# Altium schematic sheet 555 timer schematic.SchDoc
size A4; SheetNumber: 1; SheetTotal: 1
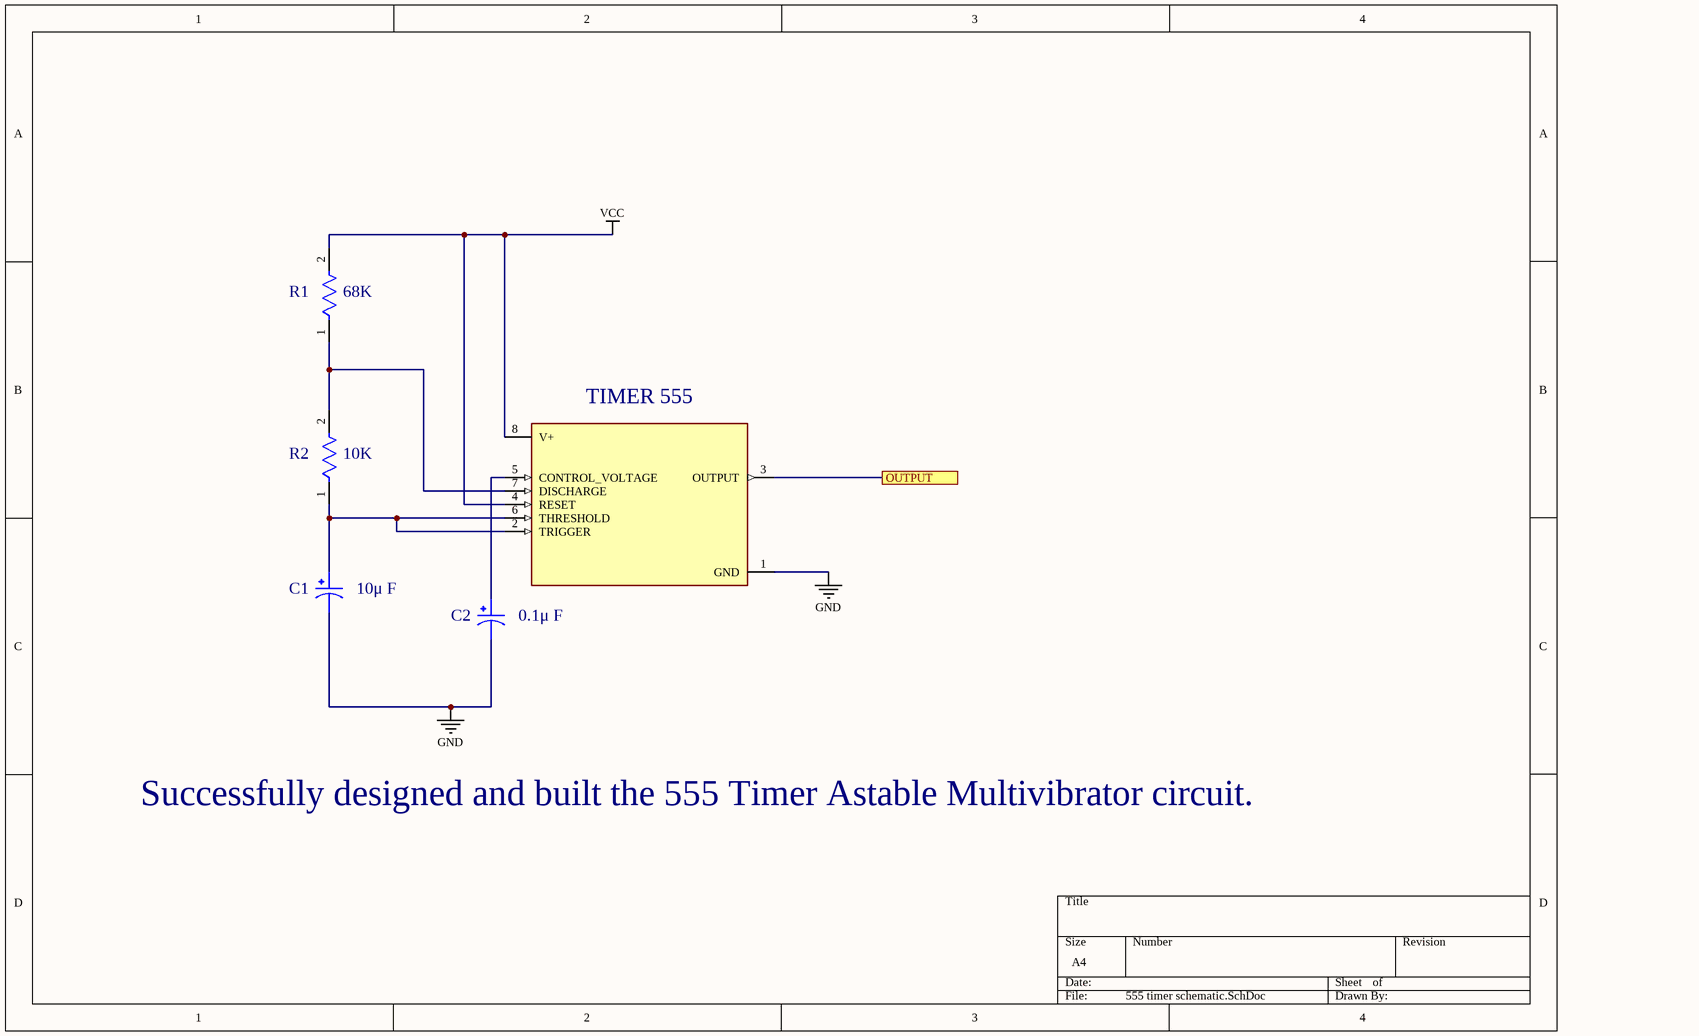
[diagram p0: 555 timer schematic.SchDoc]

## Parts
C1  10μ F  [CAPPRD500W60D1330H2700]
C2  0.1μ F  [CAPPRD500W60D1330H2700]
R1  68K  [FP-MFR-25-MFG]
R2  10K  [FP-MFR-25-MFG]
TIMER_555  LM555CN/NOPB  [DIP794W45P254L959H508Q8]  (value not drawn)

## Ports
OUTPUT 

## Nets
GND: C1.2 C2.2 TIMER_555.1(GND)
VCC: R1.2 TIMER_555.4(RESET) TIMER_555.8(V+)
OUTPUT : TIMER_555.3(OUTPUT) ; port OUTPUT 
NetC1_1: C1.1 R2.1 TIMER_555.2(TRIGGER) TIMER_555.6(THRESHOLD)
NetC2_1: C2.1 TIMER_555.5(CONTROL_VOLTAGE)
NetR1_1: R1.1 R2.2 TIMER_555.7(DISCHARGE)

## Notes on the sheet
- Successfully designed and built the 555 Timer Astable Multivibrator circuit.

## Library data of the parts
C1 C2 = 478CKS010M: 4700 ÂµF 10 V Aluminum Electrolytic Capacitors Radial, Can 98.8mOhm @ 120Hz 2000 Hrs @ 85Â°C; MF: Illinois Capacitor; SnapEDA_Link: https://www.snapeda.com/parts/478CKS010M/Illinois+Capacitor/view-part/?ref=snap; Package: Radial Illinois Capacitor; Value: *; MP: 478CKS010M; Check_prices: https://www.snapeda.com/parts/478CKS010M/Illinois+Capacitor/view-part/?ref=eda
R1 R2 = CMP-03413-000001-1: RES 1.18K OHM 1/4W 1% AXIAL; Manufacturer: Yageo; Manufacturer Part Number: MFR-25FBF52-1K18; Value: 1.18kΩ; Temperature Coefficient: 100ppm/°C; Power Rating: 0.25W; Voltage Rating: 250V; Temperature: -55°C to +155°C; Automotive: No; Temperature Range High: +155°C; Mouser Description: Metal Film Resistors 1.18K OHM 1/4W 1%; Digikey Description: RES 1.18K OHM 1/4W 1% AXIAL; Lead Free: Yes; Tolerance: 1%; ComponentLink2Description: Datasheet; ComponentLink2URL: https://www.yageo.com/upload/media/product/products/datasheet/lr/Yageo_LR_MFR_1.pdf; Temperature Range Low: -55°C; Package: MFR-25; Ipc Land Pattern Name: RESAD1000W75L680D260; Composition: Metal Film; Category: Res; Octopart: https://octopart.com/mfr-25fbf52-1k18-yageo-56251681; Series: MFR; Device Class L2: Resistors; Height: 2.6mm; Resistance: 1.18kΩ; Device Class L3: Through-Hole Resistors; RoHS: TRUE; Device Class L1: Passive Components
TIMER_555 = LM555CN/NOPB: Highly Stable 555 Timer; MF: Texas Instruments; SnapEDA_Link: https://www.snapeda.com/parts/LM555CN/NOPB/Texas+Instruments/view-part/?ref=snap; Package: PDIP-8 Texas; Value: *; MP: LM555CN/NOPB; Check_prices: https://www.snapeda.com/parts/LM555CN/NOPB/Texas+Instruments/view-part/?ref=eda